# EAGLE schematic 10ACto3.3DC (second version)  (EAGLE 9.6.2)
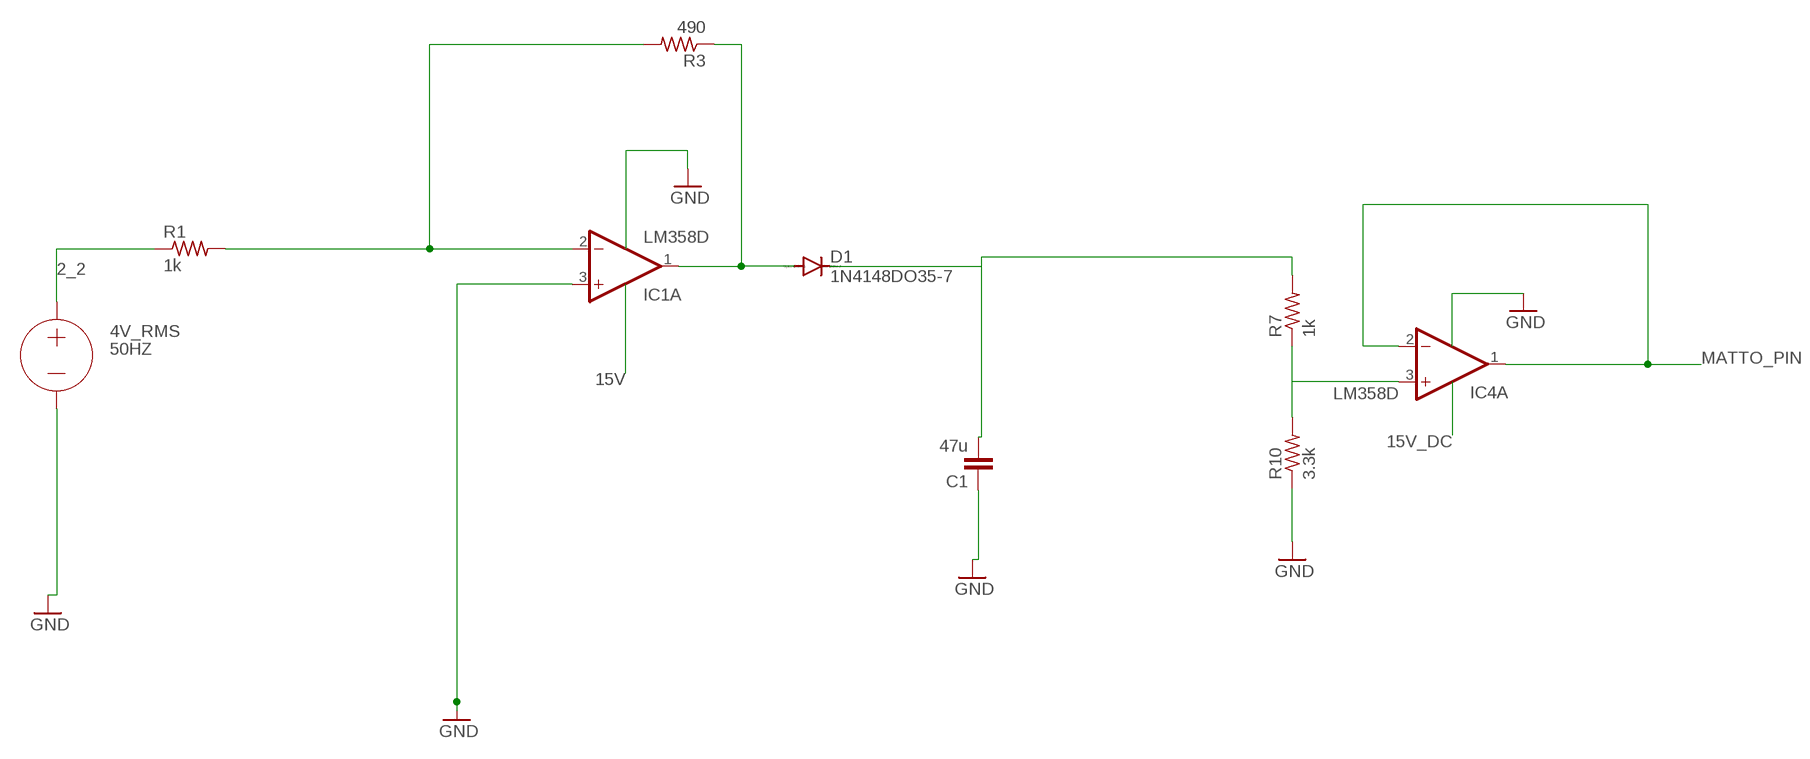
[diagram p0: schematic, sheet 1]

## Parts
4V_RMS  50HZ  VOLTAGE  (no package)
C1  47u  C2.5/2  [C2.5-2]
D1  1N4148DO35-7  [DO35-7]
IC1  LM358D  [SO08]
IC4  LM358D  [SO08]
R1  1k  R-US_0204/7  [0204/7]
R3  490  R-US_0204/7  [0204/7]
R7  1k  R-US_0204/7  [0204/7]
R10  3.3k  R-US_0204/7  [0204/7]

## Nets
2_2: 4V_RMS.+ R1.1
GND: 4V_RMS.- C1.1 IC1.3(A:+IN) R10.1
MATTO_PIN: IC4.1(A:OUT) IC4.2(A:-IN)
N$2: IC1.2(A:-IN) R1.2 R3.2
N$4: C1.2 D1.C R7.2
N$5: D1.A IC1.1(A:OUT) R3.1
N$6: R7.1 R10.2
N$21: IC4.3(A:+IN)
Unconnected: IC1.5(B:+IN) IC1.6(B:-IN) IC1.7(B:OUT) IC4.5(B:+IN) IC4.6(B:-IN) IC4.7(B:OUT)

## Power pins joined to a net without a drawn wire
V+: IC1.8(P:V+) IC4.8(P:V+)
V-: IC1.4(P:V-) IC4.4(P:V-)

## Library data of the parts
4V_RMS = ngspice-simulation:VOLTAGE: Independent Voltage Source, either DC, AC, PULSE, SINE, PWL, EXP, or SFFM; VALUE: 0V
C1 = capacitor-wima:C: CAPACITOR naming: grid - package width
D1 = diode:1N4148: DIODE high speed (Philips)
IC1 IC4 = linear:LM358: OP AMP also LM158; LM258; LM2904 Source: http://cache.national.com/ds/LM/LM158.pdf
R1 R3 R7 R10 = rcl:R-US_: RESISTOR, American symbol; SPICEPREFIX: R